# Altium schematic sheet IO_HDMI.schdoc
size 155 x 191 mm
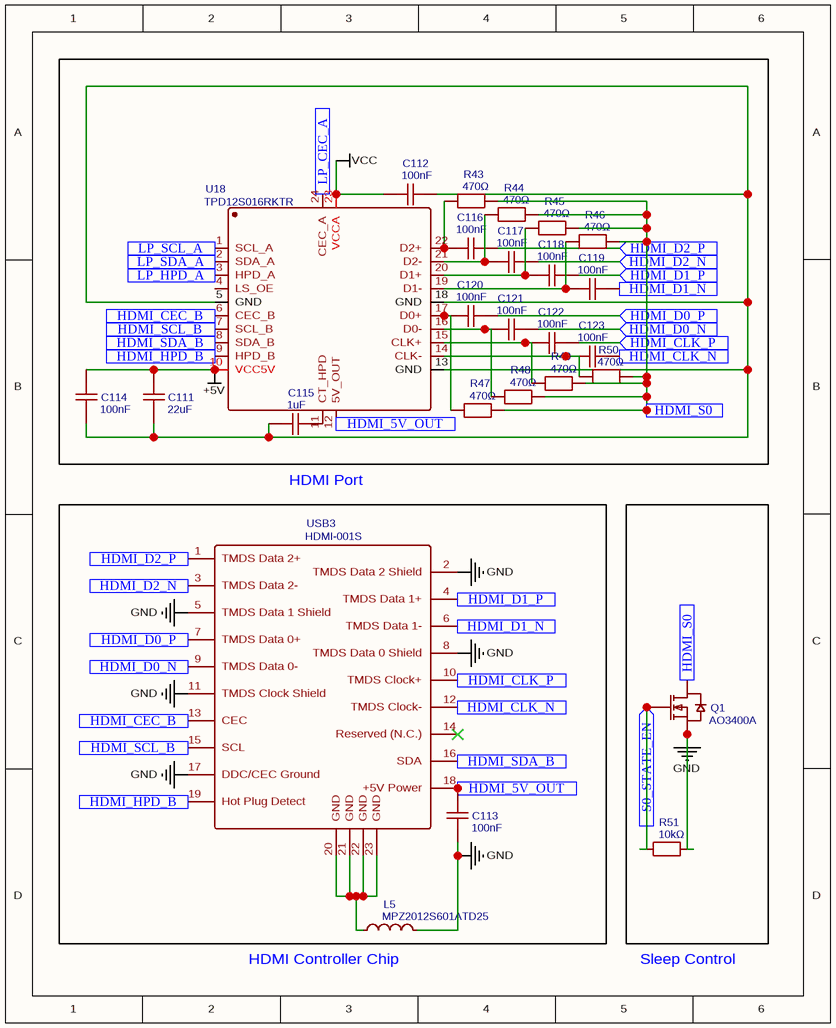
[diagram p0: IO_HDMI.schdoc]

## Parts
C111  22uF  [C0805]
C112  100nF  [C0402]
C113  100nF  [C0402]
C114  100nF  [C0402]
C115  1uF  [C0402]
C116  100nF  [C0402]
C117  100nF  [C0402]
C118  100nF  [C0402]
C119  100nF  [C0402]
C120  100nF  [C0402]
C121  100nF  [C0402]
C122  100nF  [C0402]
C123  100nF  [C0402]
L5  MPZ2012S601ATD25  [L0805]
Q1  AO3400A  [SOT-23-3_L2.9-W1.3-P1.90-LS2.4-BR]
R43  470Ω  [R0402]
R44  470Ω  [R0402]
R45  470Ω  [R0402]
R46  470Ω  [R0402]
R47  470Ω  [R0402]
R48  470Ω  [R0402]
R49  470Ω  [R0402]
R50  470Ω  [R0402]
R51  10kΩ  [R0402]
U18  TPD12S016RKTR  [UQFN-24_L4.0-W2.0-P0.40-BL]
USB3  HDMI-001S  [HDMI-SMD_HDMI-001S]

## Blocks framed on the sheet
HDMI Port: C113 L5 USB3

## Ports
HDMI_5V_OUT (in), HDMI_CEC_B (in), HDMI_CLK_N (in), HDMI_CLK_P (in), HDMI_D0_N (in), HDMI_D0_P (in), HDMI_D1_N (in), HDMI_D1_P (in), HDMI_D2_N (in), HDMI_D2_P (in), HDMI_HPD_B (in), HDMI_S0 (in), HDMI_SCL_B (in), HDMI_SDA_B (in), LP_CEC_A (in), LP_HPD_A (in), LP_SCL_A (in), LP_SDA_A (in), S0_STATE_EN (in)

## Nets
+5V: C111.2 C114.2 U18.10(VCC5V)
GND: C113.1 L5.2 Q1.2(S) R51.2 USB3.2(TMDS_Data_2_Shield) USB3.5(TMDS_Data_1_Shield) USB3.8(TMDS_Data_0_Shield) USB3.11(TMDS_Clock_Shield) USB3.17(DDC/CEC_Ground)
VCC: C112.1 U18.23(VCCA)
HDMI_5V_OUT: C113.2 U18.12(5V_OUT) USB3.18(+5V_Power) ; port HDMI_5V_OUT
HDMI_CEC_B: U18.6(CEC_B) USB3.13(CEC) ; port HDMI_CEC_B
HDMI_CLK_N: C123.1 USB3.12(TMDS_Clock-) ; port HDMI_CLK_N
HDMI_CLK_P: C122.1 USB3.10(TMDS_Clock+) ; port HDMI_CLK_P
HDMI_D0_N: C121.1 USB3.9(TMDS_Data_0-) ; port HDMI_D0_N
HDMI_D0_P: C120.1 USB3.7(TMDS_Data_0+) ; port HDMI_D0_P
HDMI_D1_N: C119.1 USB3.6(TMDS_Data_1-) ; port HDMI_D1_N
HDMI_D1_P: C118.1 USB3.4(TMDS_Data_1+) ; port HDMI_D1_P
HDMI_D2_N: C117.1 USB3.3(TMDS_Data_2-) ; port HDMI_D2_N
HDMI_D2_P: C116.1 USB3.1(TMDS_Data_2+) ; port HDMI_D2_P
HDMI_HPD_B: U18.9(HPD_B) USB3.19(Hot_Plug_Detect) ; port HDMI_HPD_B
HDMI_S0: Q1.3(D) R43.1 R44.1 R45.1 R46.1 R47.1 R48.1 R49.1 R50.1 ; port HDMI_S0
HDMI_SCL_B: U18.7(SCL_B) USB3.15(SCL) ; port HDMI_SCL_B
HDMI_SDA_B: U18.8(SDA_B) USB3.16(SDA) ; port HDMI_SDA_B
LP_CEC_A: U18.24(CEC_A) ; port LP_CEC_A
LP_HPD_A: U18.3(HPD_A) ; port LP_HPD_A
LP_SCL_A: U18.1(SCL_A) ; port LP_SCL_A
LP_SDA_A: U18.2(SDA_A) ; port LP_SDA_A
S0_STATE_EN: Q1.1(G) R51.1 ; port S0_STATE_EN
NetC111_1: C111.1 C112.2 C114.1 C115.2 U18.5(GND) U18.13(GND) U18.18(GND)
NetC115_1: C115.1 U18.11(CT_HPD)
NetC116_2: C116.2 R43.2 U18.22(D2+)
NetC117_2: C117.2 R44.2 U18.21(D2-)
NetC118_2: C118.2 R45.2 U18.20(D1+)
NetC119_2: C119.2 R46.2 U18.19(D1-)
NetC120_2: C120.2 R47.2 U18.17(D0+)
NetC121_2: C121.2 R48.2 U18.16(D0-)
NetC122_2: C122.2 R49.2 U18.15(CLK+)
NetC123_2: C123.2 R50.2 U18.14(CLK-)
NetL5_1: L5.1 USB3.20(GND) USB3.21(GND) USB3.22(GND) USB3.23(GND)

Not connected (* = marked no-connect by the designer): U18 4(LS_OE); USB3 14(Reserved_(N.C.))*

## Notes on the sheet
- (near L5) HDMI Controller Chip
- Sleep Control

## Library data of the parts
C111 = 22uF: Manufacturer: muRata(村田); Manufacturer Part: GRT21BR61E226ME13L; nameAlias: Value; Contributor: LCSC; Supplier: LCSC; Supplier Part: C398931; JLCPCB Part Class: Extended Part; spicePre: C; spiceSymbolName: GRT21BR61E226ME13L
C112-C114 C116-C123 = 100nF: Manufacturer: muRata(村田); Manufacturer Part: GRM155R71H104KE14J; Contributor: lcsc; nameAlias: Value; Supplier: LCSC; Supplier Part: C2649519; JLCPCB Part Class: Extended Part; spicePre: C; spiceSymbolName: GRM155R71H104KE14J
C115 = 1uF: Manufacturer: TAIYO YUDEN(太诱); Manufacturer Part: MSASU105CB5105KFNA01; nameAlias: Value; Contributor: lcsc; Supplier: LCSC; Supplier Part: C7001784; JLCPCB Part Class: Extended Part; spicePre: C; spiceSymbolName: MSASU105CB5105KFNA01
L5 = MPZ2012S601ATD25: Manufacturer: TDK; Contributor: LCSC; Supplier: LCSC; Supplier Part: C81034; Manufacturer Part: MPZ2012S601ATD25; JLCPCB Part Class: Extended Part; spicePre: L; spiceSymbolName: MPZ2012S601ATD25
Q1 = AO3400A: Manufacturer: AOS; Supplier: LCSC; Manufacturer Part: AO3400A; Supplier Part: C20917; JLCPCB Part Class: Basic Part; spicePre: Q; spiceSymbolName: AO3400A
R43-R50 = 470Ω: Manufacturer: FOJAN(富捷); Manufacturer Part: FRC0402F4700TS; nameAlias: Value; Contributor: lcsc; Supplier: LCSC; Supplier Part: C2909361; JLCPCB Part Class: Extended Part; spicePre: R; spiceSymbolName: FRC0402F4700TS
R51 = 10kΩ: Manufacturer: FOJAN(富捷); Manufacturer Part: FRC0402F1002TS; nameAlias: Value; Contributor: LCSC; Supplier: LCSC; Supplier Part: C2906861; JLCPCB Part Class: Extended Part; spicePre: R; spiceSymbolName: FRC0402F1002TS
U18 = TPD12S016RKTR: Manufacturer: TI(德州仪器); Contributor: LCSC; Supplier: LCSC; Supplier Part: C165140; Manufacturer Part: TPD12S016RKTR; JLCPCB Part Class: Extended Part; spicePre: U; spiceSymbolName: TPD12S016RKTR
USB3 = HDMI-001S: Manufacturer: XUNPU(讯普); Contributor: LCSC; Supplier: LCSC; Supplier Part: C720616; Manufacturer Part: HDMI-001S; JLCPCB Part Class: Extended Part; spicePre: U; spiceSymbolName: HDMI-001S